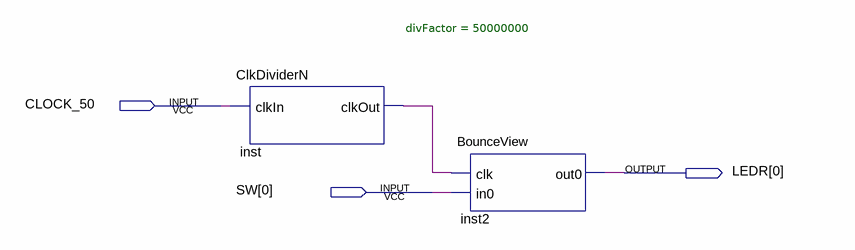
[diagram p0: schematic sheet]
// Quartus schematic Bounce_Demo.bdf as structural Verilog: 2 symbols, 3 pins
module Bounce_Demo (
  input  CLOCK_50,
  input  [0:0] SW,
  output [0:0] LEDR
);

  wire inst_clkout;

  ClkDividerN #(.divFactor(50000000)) inst (.clkIn(CLOCK_50), .clkOut(inst_clkout));
  BounceView inst2 (.clk(inst_clkout), .in0(SW[0]), .out0(LEDR[0]));
endmodule
